# Altium schematic sheet Supply_DAC.SchDoc: Zotino
size 420 x 297 mm; Author: G.K.; CompanyName: WUT; DrawnBy: G.K.; Organization: WUT ISE; Address1: Warsaw Univeristy of Technology; Address2: Nowowiejska 15/19; DocumentNumber: 5; Revision: -; SheetNumber: 5; SheetTotal: 7; EDA_Number: ARTIQ; Projet: Zotino; ModifiedBy: -; CreateDate: XX/XX/XXXX; CheckedDate: -; Title2: Power supply v1.1; DivGrp: ISE; Designer: G.K.; ModifiedDate: -; ProjectName: 32 CHANNEL 16bit DAC
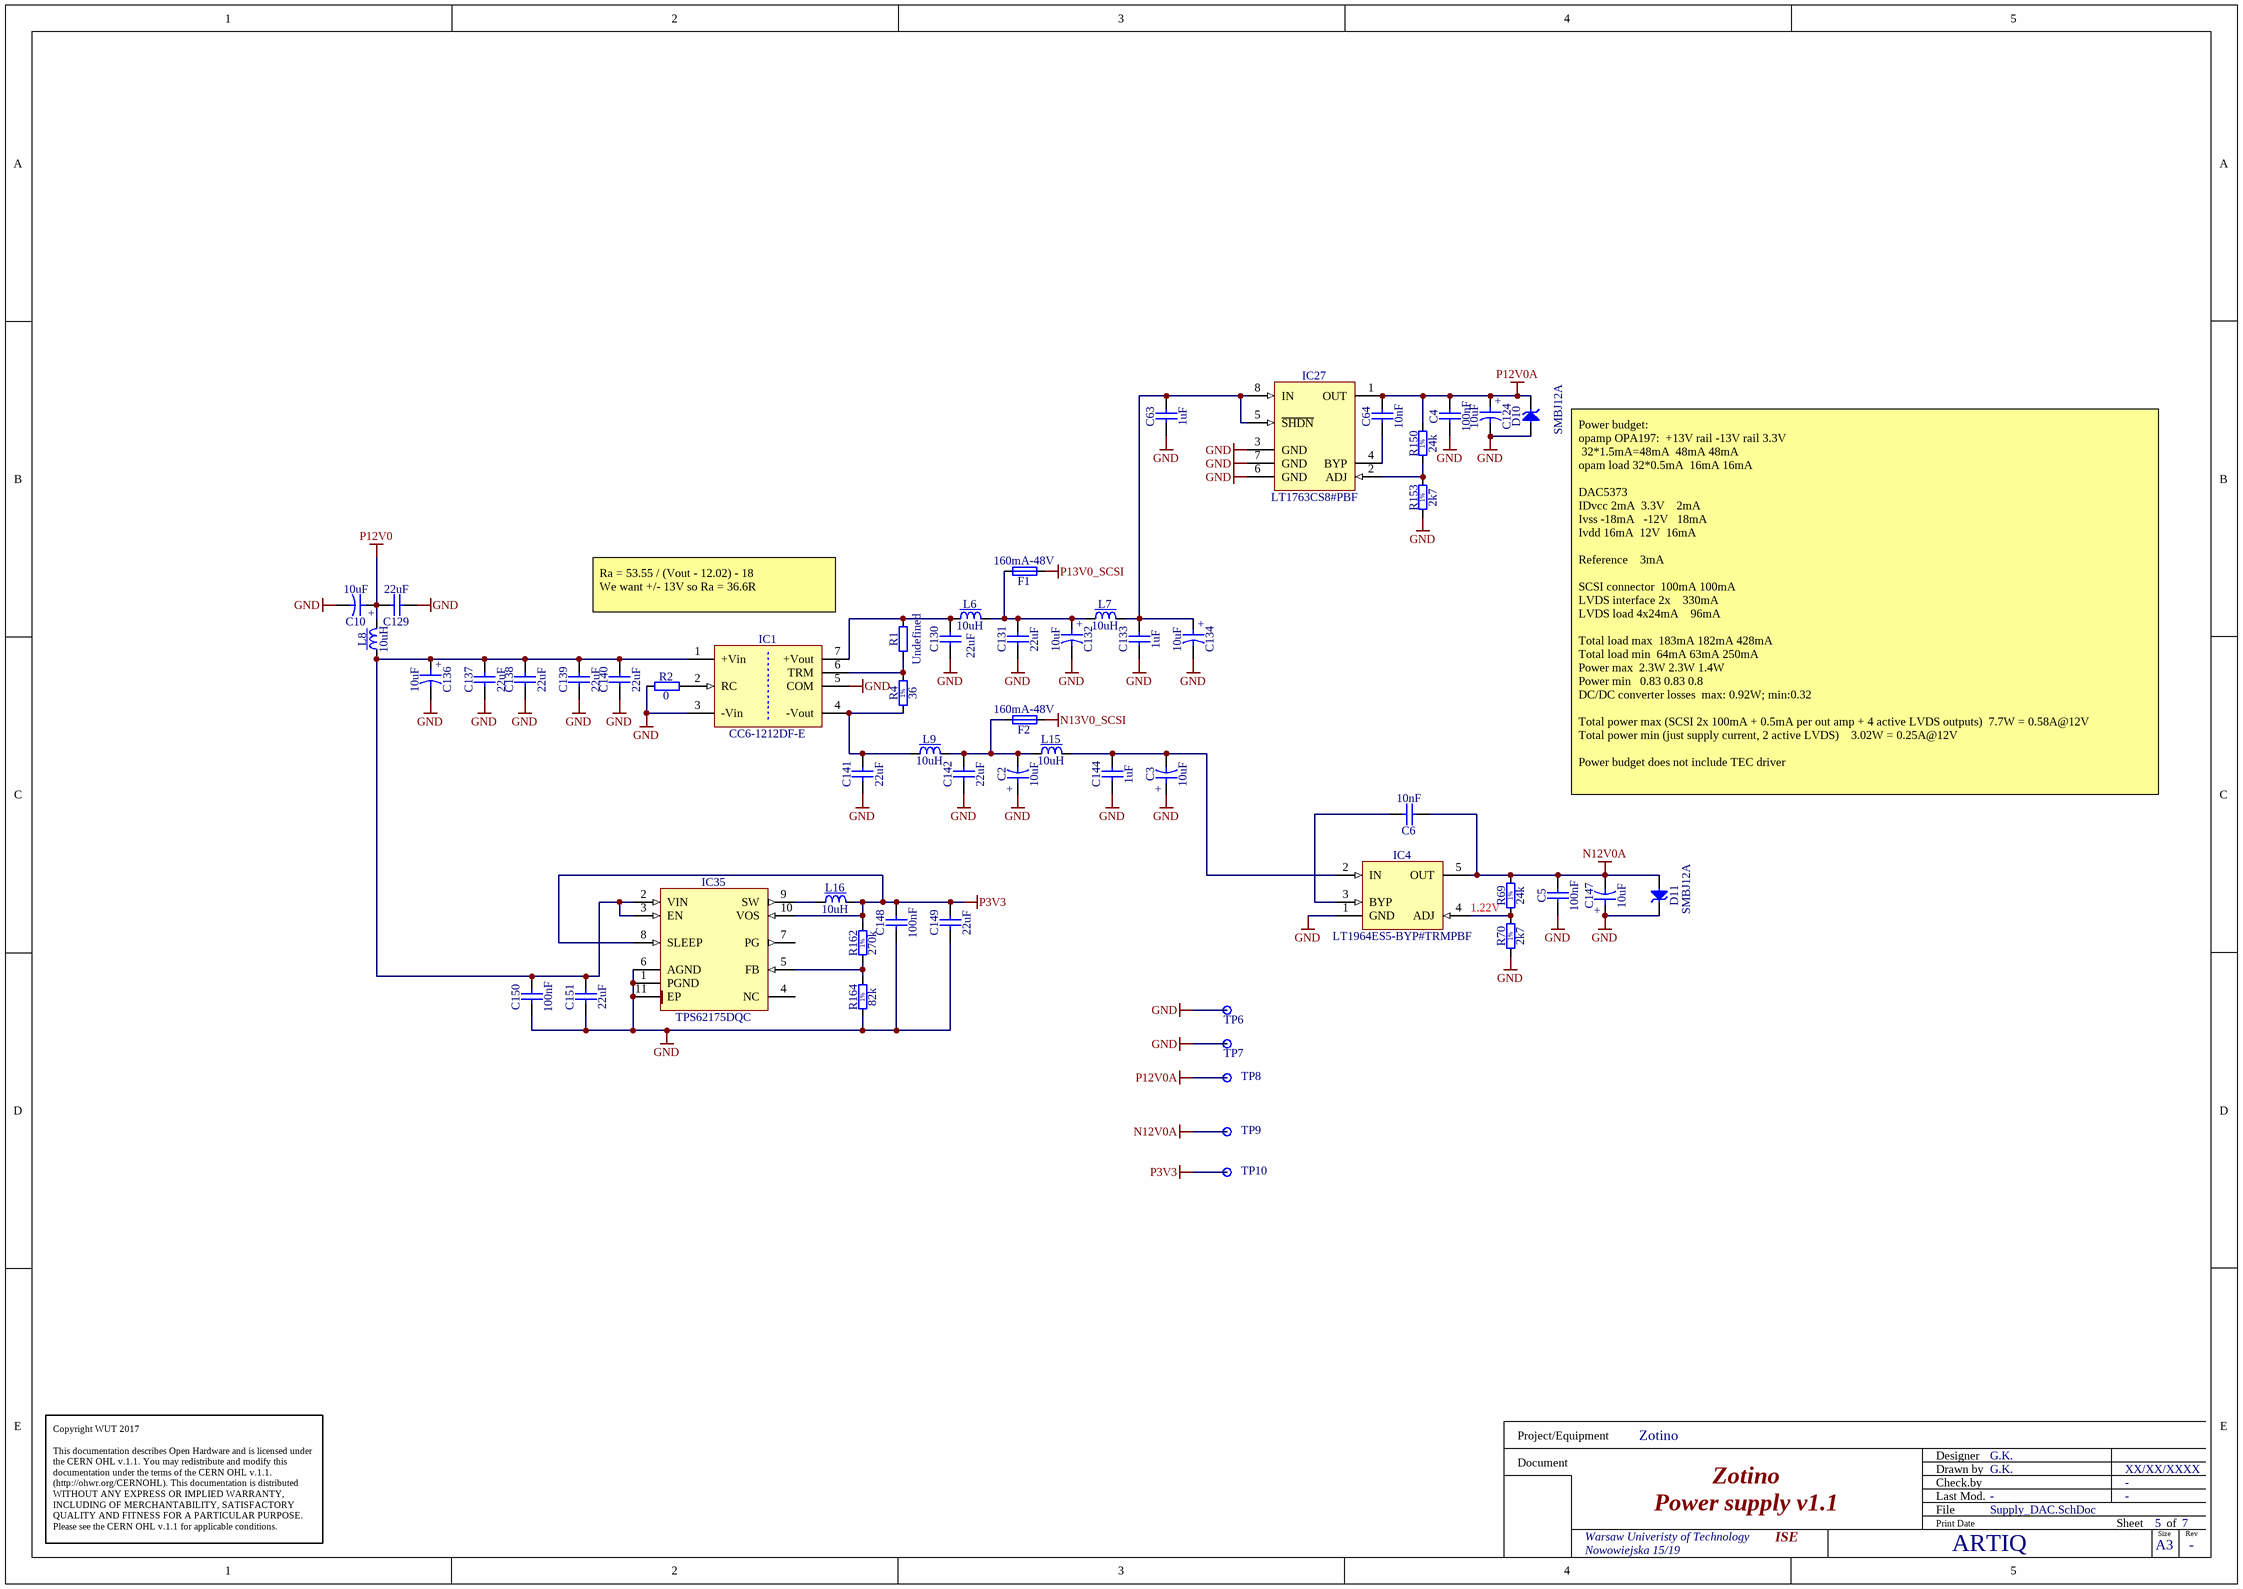
[diagram p0: Supply_DAC.SchDoc]

## Parts
C2  10uF  [CAPMP3216X180N]
C3  10uF  [CAPMP3216X180N]
C4  100nF  [CAPC1005X55N]
C5  100nF  [CAPC1005X55N]
C6  10nF  [CAPC1608X87N]
C10  10uF  [CAPMP3216X180N]
C63  1uF  [CAPC1608X87N]
C64  10nF  [CAPC1608X87N]
C124  10uF  [CAPMP3216X180N]
C129  22uF  [CAPC2012X135N]
C130  22uF  [CAPC2012X135N]
C131  22uF  [CAPC2012X135N]
C132  10uF  [CAPMP3216X180N]
C133  1uF  [CAPC1608X87N]
C134  10uF  [CAPMP3216X180N]
C136  10uF  [CAPMP3216X180N]
C137  22uF  [CAPC2012X135N]
C138  22uF  [CAPC2012X135N]
C139  22uF  [CAPC2012X135N]
C140  22uF  [CAPC2012X135N]
C141  22uF  [CAPC2012X135N]
C142  22uF  [CAPC2012X135N]
C144  1uF  [CAPC1608X87N]
C147  10uF  [CAPMP3216X180N]
C148  100nF  [CAPC1005X55N]
C149  22uF  [CAPC2012X135N]
C150  100nF  [CAPC1005X55N]
C151  22uF  [CAPC2012X135N]
D10  SMBJ12A  [DIOM5336X265N]
D11  SMBJ12A  [DIOM5336X265N]
F1  160mA-48V  [FUSRC3216X100N]
F2  160mA-48V  [FUSRC3216X100N]
IC1  CC6-1212DF-E  [CC6-1212DF-E]
IC4  LT1964ES5-BYP#TRMPBF  [SOT95P280X100-5N]
IC27  LT1763CS8#PBF  [SOIC127P600X175-8N]
IC35  TPS62175DQC  [SON50P200X300X80-11N-R94X250]
L6  10uH  [IND_MURATA-PS_8400]
L7  10uH  [IND_MURATA-PS_8400]
L8  10uH  [IND_MURATA-PS_8400]
L9  10uH  [IND_MURATA-PS_8400]
L15  10uH  [IND_MURATA-PS_8400]
L16  10uH  [IND_MURATA-PS_8400]
R1  Undefined  [RESC1608X55N]
R2  0  [RESC1005X40N]
R4  36  [RESC1608X55N]
R69  24k  [RESC1608X55N]
R70  2k7  [RESC1608X55N]
R150  24k  [RESC1608X55N]
R153  2k7  [RESC1608X55N]
R162  270k  [RESC1608X55N]
R164  82k  [RESC1608X55N]
TP6  Test Point  [TPS127]  (value not drawn)
TP7  Test Point  [TPS127]  (value not drawn)
TP8  Test Point  [TPS127]  (value not drawn)
TP9  Test Point  [TPS127]  (value not drawn)
TP10  Test Point  [TPS127]  (value not drawn)

## Nets
GND: C2.1 C3.1 C4.1 C5.1 C10.2 C63.1 C124.2 C129.1 C130.1 C131.1 C132.2 C133.1 C134.2 C136.2 C137.1 C138.1 C139.1 C140.1 C141.1 C142.1 C144.1 C147.1 C148.1 C149.1 C150.1 C151.1 D10.2(A) D11.1(C) IC1.3(-Vin) IC1.5(COM) IC4.1(GND) IC27.3(GND) IC27.6(GND) IC27.7(GND) IC35.1(PGND) IC35.6(AGND) IC35.11(EP) R2.1 R70.1 R153.1 R164.1 TP6.1 TP7.1
N12V0A: C5.2 C6.1 C147.2 D11.2(A) IC4.5(OUT) R69.2 TP9.1
N13V0_SCSI: F2.1
P3V3: C148.2 C149.2 IC35.8(SLEEP) IC35.10(VOS) L16.2 R162.2 TP10.1
P12V0: C10.1 C129.2 L8.2
P12V0A: C4.2 C64.2 C124.1 D10.1(C) IC27.1(OUT) R150.2 TP8.1
P13V0_SCSI: F1.1
NetC2_2: C2.2 C142.2 F2.2 L9.2 L15.1
NetC3_2: C3.2 C144.2 IC4.2(IN) L15.2
NetC6_2: C6.2 IC4.3(BYP)
NetC63_2: C63.2 C133.2 C134.1 IC27.5(~{SHDN}) IC27.8(IN) L7.2
NetC64_1: C64.1 IC27.4(BYP)
NetC130_2: C130.2 IC1.7(+Vout) L6.1 R1.2
NetC131_2: C131.2 C132.1 F1.2 L6.2 L7.1
NetC136_1: C136.1 C137.2 C138.2 C139.2 C140.2 C150.2 C151.2 IC1.1(+Vin) IC35.2(VIN) IC35.3(EN) L8.1
NetC141_2: C141.2 IC1.4(-Vout) L9.1 R4.1
NetIC1_2: IC1.2(RC) R2.2
NetIC1_6: IC1.6(TRM) R1.1 R4.2
NetIC4_4: IC4.4(ADJ) R69.1 R70.2
NetIC27_2: IC27.2(ADJ) R150.1 R153.2
NetIC35_5: IC35.5(FB) R162.1 R164.2
NetIC35_9: IC35.9(SW) L16.1

Not connected (* = marked no-connect by the designer): IC35 4(NC) 7(PG)

## Notes on the sheet
- Ra = 53.55 / (Vout - 12.02) - 18
  We want +/- 13V so Ra = 36.6R
- (near D10) Power budget:
  opamp OPA197:		+13V rail	-13V rail	3.3V
  32*1.5mA=48mA		48mA	48mA
  opam load	32*0.5mA		16mA	16mA
  DAC5373
  IDvcc 2mA  3.3V				2mA
  Ivss -18mA   -12V			18mA
  Ivdd 16mA  12V		16mA
  Reference 			3mA
  SCSI connector		100mA	100mA
  LVDS interface 2x				330mA
  LVDS load 4x24mA				96mA
  Total load	max		183mA	182mA	428mA
  Total load min		64mA	63mA	250mA
  Power max		2.3W	2.3W	1.4W
  Power min			0.83	0.83	0.8
  DC/DC converter losses 	max: 0.92W; min:0.32
  Total power max (SCSI 2x 100mA + 0.5mA per out amp + 4 active LVDS outputs) 	7.7W = 0.58A@12V
  Total power min (just supply current, 2 active LVDS)				3.02W = 0.25A@12V
  Power budget does not include TEC driver
- 1.22V
- Copyright WUT 2017
  This documentation describes Open Hardware and is licensed under the CERN OHL v.1.1. You may redistribute and modify this documentation under the terms of the CERN OHL v.1.1. (http://ohwr.org/CERNOHL). This documentation is distributed WITHOUT ANY EXPRESS OR IMPLIED WARRANTY, INCLUDING OF MERCHANTABILITY, SATISFACTORY QUALITY AND FITNESS FOR A PARTICULAR PURPOSE. Please see the CERN OHL v.1.1 for applicable conditions.
- Project/Equipment
- Document
- Designer
- Drawn by
- Check.by
- File
- Last Mod.
- Print Date
- Sheet
- Size
- A3
- of
- Rev
- (in symbol CTE3216-18_10UF_16V_20%_AVX_TCJ) +
- (in symbol R0603_2K7_1%_0.1W_100PPM) 1%
- (in symbol R0603_24K_1%_0.1W_100PPM) 1%
- (in symbol R0603_36R_1%_0.1W_100PPM) 1%
- (in symbol R0603_82K_1%_0.1W_100PPM) 1%
- (in symbol R0603_270K_1%_0.1W_100PPM) 1%

## Library data of the parts
C2 C3 C10 C124 C132 C134 C136 C147 = CTE3216-18_10UF_16V_20%_AVX_TCJ: Polarised capacitor; Part Description: ESR 0R200 Tantalum Solid Electrolytic Chip Capacitor with Conductive Polymer Electrode; Manufacturer: AVX; Manufacturer Part Number: TCJA106M016R0200; Voltage: 16V; Tolerance: ±20%; Part Number: CTE3216-18_10UF_16V_20%_AVX_TCJ; Component Kind: Standard; Component Type: Standard; Pin Count: 2; Value: 10uF; Status: Preferred; Case: A; Mounted: Yes; Socket: No; SMD: Yes; Sense: No; ComponentHeight: 1.8mm; HelpURL: \\cern.ch\dfs\Applications\Altium\Datasheets\CTE_AVX_TCJ.pdf; Author: CERN DEM JLC; CreateDate: 29.03.2012; LatestRevisionDate: 29.03.2012
C4 C5 C148 C150 = CC0402_100NF_16V_10%_X5R: Non-polarised capacitor; Part Description: SMD Multilayer Chip Ceramic Capacitor; Manufacturer: GENERIC; Manufacturer1 Part Number: GRM155R61C104KA88D; Voltage: 16V; TC: X5R; Tolerance: ±10%; Part Number: CC0402_100NF_16V_10%_X5R; Component Kind: Standard; Component Type: Standard; Pin Count: 2; Value: 100nF; Status: None; Manufacturer Part Number: CC0402_100NF_16V_10%_X5R; Case: 0402; Mounted: Yes; Socket: No; SMD: Yes; Sense: No; Manufacturer1 Example: MURATA; Manufacturer1 ComponentHeight: 0.55mm; HelpURL: \\cern.ch\dfs\Applications\Altium\Datasheets\CC0402_X5R_MURATA_GRM.pdf; Author: CERN DEM JLC; CreateDate: 10.12.2013; LatestRevisionDate: 10.12.2013
C6 C64 = CC0603_10NF_50V_10%_X7R: Non-polarised capacitor; Part Description: SMD Multilayer Chip Ceramic Capacitor; Manufacturer: GENERIC; Manufacturer1 Part Number: 223858615636; Voltage: 50V; TC: X7R; Tolerance: ±10%; Part Number: CC0603_10NF_50V_10%_X7R; Component Kind: Standard; Component Type: Standard; Pin Count: 2; Value: 10nF; Status: Preferred; Manufacturer Part Number: CC0603_10NF_50V_10%_X7R; Case: 0603; Mounted: Yes; Socket: No; SMD: Yes; Sense: No; Manufacturer1 Example: PHYCOMP; Manufacturer1 ComponentHeight: 0.87mm; HelpURL: \\cern.ch\dfs\Applications\Altium\Datasheets\CC0603_X7R_PHYCOMP.pdf; Author: CERN DEM JLC; CreateDate: 03.12.2007; LatestRevisionDate: 03.12.2007
C63 C133 C144 = CC0603_1UF_25V_10%_X7R: Non-polarised capacitor; Part Description: SMD Multilayer Chip Ceramic Capacitor; Manufacturer: GENERIC; Manufacturer1 Part Number: GRM188R71E105KA12D; Voltage: 25V; TC: X7R; Tolerance: ±10%; Part Number: CC0603_1UF_25V_10%_X7R; Component Kind: Standard; Component Type: Standard; Pin Count: 2; Value: 1uF; Status: None; Manufacturer Part Number: CC0603_1UF_25V_10%_X7R; Case: 0603; Mounted: Yes; Socket: No; SMD: Yes; Sense: No; Manufacturer1 Example: MURATA; Manufacturer1 ComponentHeight: 0.9mm; HelpURL: \\cern.ch\dfs\Applications\Altium\Datasheets\CC0603_X7R_MURATA.pdf; Author: CERN DEM JLC; CreateDate: 18.01.2011; LatestRevisionDate: 18.01.2011
C129-C131 C137-C142 C149 C151 = CC0805_22UF_16V_10%_X5R: Non-polarised capacitor; Part Description: SMD Multilayer Chip Ceramic Capacitor; Manufacturer: GENERIC; Manufacturer1 Part Number: C2012X5R1C226KT; Voltage: 16V; TC: X5R; Tolerance: ±10%; Part Number: CC0805_22UF_16V_10%_X5R; Component Kind: Standard; Component Type: Standard; Pin Count: 2; Value: 22uF; Status: Preferred; Manufacturer Part Number: CC0805_22UF_16V_10%_X5R; Case: 0805; Mounted: Yes; Socket: No; SMD: Yes; Sense: No; Manufacturer1 Example: TDK; Manufacturer1 ComponentHeight: 1.35mm; HelpURL: \\cern.ch\dfs\Applications\Altium\Datasheets\CC0805_X5R_TDK_C.pdf; Author: CERN DEM JLC; CreateDate: 25.10.2012; LatestRevisionDate: 25.10.2012
D10 D11 = SMBJ12A: Zener Diode; Part Description: Uni-Directional Transient Voltage Suppressor Diode; Manufacturer: FAIRCHILD SEMICONDUCTOR; Voltage: 12V; Power: 600W; PressFit: No; Bonding: No; Part Number: SMBJ12A; Component Kind: Standard; Component Type: Standard; Device: SMBJ12A; PackageDescription: DO-214-AA/SMB Diode, Molded Body; 5.34mm L X 3.625mm W X 2.65mm H, IPC Medium Density; Manufacturer Part Number: SMBJ12A; Pin Count: 2; Case: DO-214AA; Mounted: Yes; Socket: No; SMD: Yes; Sense: No; ComponentHeight: 2.65mm; HelpURL: \\cern.ch\dfs\Applications\Altium\Datasheets\SMBJ.pdf; Author: CERN DEM JLC; CreateDate: 10.04.2013; LatestRevisionDate: 10.04.2013
F1 F2 = FUSR1206_TYCO-NANOSMD016F: Fuse; Part Description: PolySwitch® PTC Overcurrent Protection Device; Manufacturer: TYCO ELECTRONICS; Manufacturer Part Number: nanoSMDC016F; PressFit: No; Part Number: FUSR1206_TYCO-NANOSMD016F; Component Kind: Standard; Component Type: Standard; Pin Count: 2; PackageDescription: Chip Resettable Fuse, 2-Leads, Body 3.2mmx1.6mm, IPC Medium Density; Family: Fuses Resettable; Mounted: Yes; Socket: No; SMD: Yes; Sense: No; Value: 160mA-48V; ComponentHeight: 1mm; HelpURL: \\cern.ch\dfs\Applications\Altium\Datasheets\FUSR_TYCO_NanoSMD016F.pdf; Author: CERN DEM JLC; CreateDate: 03.07.2008; LatestRevisionDate: 04.08.2008
IC1 = DC/DC_CC6-1212DF-E: CONV DC/DC 6W DUAL 12V +-12V PCB; Manufacturer: TDK-Lambda Americas Inc.; PressFit: No; Bonding: No; Part Number: CC6-1212DF-E; Component Kind: Standard; Component Type: Standard; Device: CC6-1212DF-E; PackageDescription: CC6 Series, Body 0.900 x 0.831 x 0.335, Regulated; Part Description: CONV DC/DC 6W DUAL 12V +-12V PCB; Manufacturer Part Number: CC6-1212DF-E; Pin Count: 7; Mounted: Yes; Socket: No; SMD: No; Sense: No; ComponentHeight: 10.45mm; Author: GK; CreateDate: 17.12.2016; LatestRevisionDate: 17.12.2016
IC4 = LT1964ES5-BYP#TRMPBF: 200mA, Low Noise, Low Dropout Negative Micropower Regulator; Part Description: -1.22V to -20V, 200mA, Low Noise, Low Dropout Negative Micropower Regulator; Manufacturer: LINEAR TECHNOLOGY; PressFit: No; Bonding: No; Part Number: LT1964ES5-BYP#TRMPBF; Component Kind: Standard; Component Type: Standard; Device: LT1964ES5-BYP#TRMPBF; PackageDescription: SOT23, 0.95mm pitch; 5 pin, 1.75mm W X 3.00mm L, IPC Medium Density; Manufacturer Part Number: LT1964ES5-BYP#TRMPBF; Pin Count: 5; Case: SOT23-5; Mounted: Yes; Socket: No; SMD: Yes; Sense: No; ComponentHeight: 1mm; HelpURL: \\cern.ch\dfs\Applications\Altium\Datasheets\LT1964ES5-BYP#TRMPBF.pdf; Author: CERN DEM MR; CreateDate: 17.02.2016; LatestRevisionDate: 17.02.2016
IC27 = LT1763CS8#PBF: 1.22V to 20V 500mA, Low Noise, LDO Adjustable Micropower Regulator; Manufacturer: LINEAR TECHNOLOGY; PressFit: No; Bonding: No; Part Number: LT1763CS8#PBF; Component Kind: Standard; Component Type: Standard; Device: LT1763CS8#PBF; PackageDescription: SOIC 8, Pitch 1.27mm, Body 4x5mm, IPC Medium Density; Part Description: 1.22V to 20V 500mA, Low Noise, LDO Adjustable Micropower Regulator; Manufacturer Part Number: LT1763CS8#PBF; Pin Count: 8; Case: SOIC8; Mounted: Yes; Socket: No; SMD: Yes; Sense: No; ComponentHeight: 1.75mm; HelpURL: \\cern.ch\dfs\Applications\Altium\Datasheets\LT1763CS8#PBF.pdf; Author: CERN DEM JLC; CreateDate: 11.01.2010; LatestRevisionDate: 11.01.2010
IC35 = TPS62175DQC: 4.75-28VDC to 1-6VDC, 500mA Step-Down Converter With Sleep Mode; Manufacturer: TEXAS INSTRUMENTS; PressFit: No; Bonding: No; Part Number: TPS62175DQC; Component Kind: Standard; Component Type: Standard; Device: TPS62175DQC; PackageDescription: SON, 10-Leads, Body 2x3mm, Pitch 0.5mm, Thermal Pad 0.94x2.5mm, IPC Medium Density; Part Description: 4.75-28VDC to 1-6VDC, 500mA Step-Down Converter With Sleep Mode; Manufacturer Part Number: TPS62175DQC; Pin Count: 11; Case: SON10; Mounted: Yes; Socket: No; SMD: Yes; Sense: No; ComponentHeight: 0.8mm; HelpURL: \\cern.ch\dfs\Applications\Altium\Datasheets\TPS62175DQC.pdf; Author: CERN DEM JMW; CreateDate: 11.08.2015; LatestRevisionDate: 11.08.2015
L6-L9 L15 L16 = IND_10UH_10%_MURATA-PS_8400: Inductor With Core; Part Description: Miniature Surface Mount Power Inductor (8400 Serie); Manufacturer: MURATA POWER SOLUTIONS; Manufacturer Part Number: 84103C; Power: 950mA; Resistance: 0.24R; Tolerance: ±10%; Part Number: IND_10UH_10%_MURATA-PS_8400; Component Kind: Standard; Component Type: Standard; Pin Count: 2; Value: 10uH; Status: None; Mounted: Yes; Socket: No; SMD: Yes; Sense: No; ComponentHeight: 2.9mm; HelpURL: \\cern.ch\dfs\Applications\Altium\Datasheets\IND_MURATA-PS_8400.pdf; Author: CERN DEM JLC; CreateDate: 02.07.2012; LatestRevisionDate: 02.07.2012
R1 = R0603_NO-VALUE: Resistor; Part Description: Reserved Footprint For a 0603 (1608) Chip Resistor; Mounted: No; Part Number: R0603_NO-VALUE; Component Kind: Standard; Component Type: Standard; Pin Count: 2; Value: Undefined; Status: None; Manufacturer: Undefined; Manufacturer Part Number: R0603_NO-VALUE; Case: 0603; Sense: No; Socket: No; SMD: Yes; Manufacturer1 Example: Undefined; Manufacturer1 Part Number: Undefined; Manufacturer1 ComponentHeight: Undefined; HelpURL: Undefined; Author: CERN DEM JLC; CreateDate: 03.12.2007; LatestRevisionDate: 13.03.2008
R2 = R0402_0R_JUMPER: Resistor; Part Description: 1A (0.05R Max DC Resistance) Zero Ohm Jumper; Manufacturer: GENERIC; Manufacturer1 Part Number: 232270591001L; Part Number: R0402_0R_JUMPER; Component Kind: Standard; Component Type: Standard; Pin Count: 2; Value: 0; Status: Not recommended; Manufacturer Part Number: R0402_0R_JUMPER; Case: 0402; Mounted: Yes; Sense: No; Socket: No; SMD: Yes; Manufacturer1 Example: YAGEO PHYCOMP; Manufacturer1 ComponentHeight: 0.4mm; HelpURL: \\cern.ch\dfs\Applications\Altium\Datasheets\R0402_Phycomp_RC0402.pdf; Author: CERN DEM JLC; CreateDate: 03.12.2007; LatestRevisionDate: 17.10.2012
R4 = R0603_36R_1%_0.1W_100PPM: Resistor - 1%; Part Description: General Purpose Thick Film Chip Resistor; Manufacturer: GENERIC; Manufacturer1 Part Number: NRC06F36R0TRF; Power: 0.1W; TC: ±100ppm/°C; Part Number: R0603_36R_1%_0.1W_100PPM; Component Kind: Standard; Component Type: Standard; Pin Count: 2; Value: 36; Status: Preferred; Tolerance: ±1%; Manufacturer Part Number: R0603_36R_1%_0.1W_100PPM; Case: 0603; Mounted: Yes; Sense: No; Socket: No; SMD: Yes; Manufacturer1 Example: NIC COMPONENT; Manufacturer1 ComponentHeight: 0.55mm; HelpURL: \\cern.ch\dfs\Applications\Altium\Datasheets\R0603_NIC_NRC.pdf; Author: CERN DEM JLC; CreateDate: 03.12.2007; LatestRevisionDate: 13.03.2008
R69 R150 = R0603_24K_1%_0.1W_100PPM: Resistor - 1%; Part Description: General Purpose Thick Film Chip Resistor; Manufacturer: GENERIC; Manufacturer1 Part Number: NRC06F2402TRF; Power: 0.1W; TC: ±100ppm/°C; Part Number: R0603_24K_1%_0.1W_100PPM; Component Kind: Standard; Component Type: Standard; Pin Count: 2; Value: 24k; Status: Preferred; Tolerance: ±1%; Manufacturer Part Number: R0603_24K_1%_0.1W_100PPM; Case: 0603; Mounted: Yes; Sense: No; Socket: No; SMD: Yes; Manufacturer1 Example: NIC COMPONENT; Manufacturer1 ComponentHeight: 0.55mm; HelpURL: \\cern.ch\dfs\Applications\Altium\Datasheets\R0603_NIC_NRC.pdf; Author: CERN DEM JLC; CreateDate: 03.12.2007; LatestRevisionDate: 13.03.2008
R70 R153 = R0603_2K7_1%_0.1W_100PPM: Resistor - 1%; Part Description: General Purpose Thick Film Chip Resistor; Manufacturer: GENERIC; Manufacturer1 Part Number: RC0603FR-072K7L; Power: 0.1W; TC: ±100ppm/°C; Part Number: R0603_2K7_1%_0.1W_100PPM; Component Kind: Standard; Component Type: Standard; Pin Count: 2; Value: 2k7; Status: Preferred; Tolerance: ±1%; Manufacturer Part Number: R0603_2K7_1%_0.1W_100PPM; Case: 0603; Mounted: Yes; Sense: No; Socket: No; SMD: Yes; Manufacturer1 Example: YAGEO PHYCOMP; Manufacturer1 ComponentHeight: 0.55mm; HelpURL: \\cern.ch\dfs\Applications\Altium\Datasheets\R0603_PHYCOMP_RC0603.pdf; Author: CERN DEM JLC; CreateDate: 02.05.2011; LatestRevisionDate: 02.05.2011
R162 = R0603_270K_1%_0.1W_100PPM: Resistor - 1%; Part Description: General Purpose Thick Film Chip Resistor; Manufacturer: GENERIC; Manufacturer1 Part Number: NRC06F2703TRF; Power: 0.1W; TC: ±100ppm/°C; Part Number: R0603_270K_1%_0.1W_100PPM; Component Kind: Standard; Component Type: Standard; Pin Count: 2; Value: 270k; Status: Preferred; Tolerance: ±1%; Manufacturer Part Number: R0603_270K_1%_0.1W_100PPM; Case: 0603; Mounted: Yes; Sense: No; Socket: No; SMD: Yes; Manufacturer1 Example: NIC COMPONENT; Manufacturer1 ComponentHeight: 0.55mm; HelpURL: \\cern.ch\dfs\Applications\Altium\Datasheets\R0603_NIC_NRC.pdf; Author: CERN DEM JLC; CreateDate: 03.12.2007; LatestRevisionDate: 13.03.2008
R164 = R0603_82K_1%_0.1W_100PPM: Resistor - 1%; Part Description: General Purpose Thick Film Chip Resistor; Manufacturer: GENERIC; Manufacturer1 Part Number: NRC06F8202TRF; Power: 0.1W; TC: ±100ppm/°C; Part Number: R0603_82K_1%_0.1W_100PPM; Component Kind: Standard; Component Type: Standard; Pin Count: 2; Value: 82k; Status: Preferred; Tolerance: ±1%; Manufacturer Part Number: R0603_82K_1%_0.1W_100PPM; Case: 0603; Mounted: Yes; Sense: No; Socket: No; SMD: Yes; Manufacturer1 Example: NIC COMPONENT; Manufacturer1 ComponentHeight: 0.55mm; HelpURL: \\cern.ch\dfs\Applications\Altium\Datasheets\R0603_NIC_NRC.pdf; Author: CERN DEM JLC; CreateDate: 03.12.2007; LatestRevisionDate: 13.03.2008
TP6-TP10 = SMD_PAD_1.27X1.27MM: Part Description: 1.27mm x 1.27mm PCB Copper Area (SMD Test Point); Mounted: No; Part Number: SMD_PAD_1.27X1.27MM; Component Kind: Standard (No BOM); Component Type: Standard (No BOM); Pin Count: 1; Family: Test Point; Socket: No; SMD: Yes; Sense: No; Status: None; ComponentHeight: 0mm; HelpURL: Undefined; Author: CERN DEM JLC; CreateDate: 12.01.2008; LatestRevisionDate: 12.01.2008; PackageDescription: 1.27mm x 1.27mm PCB Copper Area (SMD Test Point)